# Altium project Project_Soldeerbout.PrjPcb
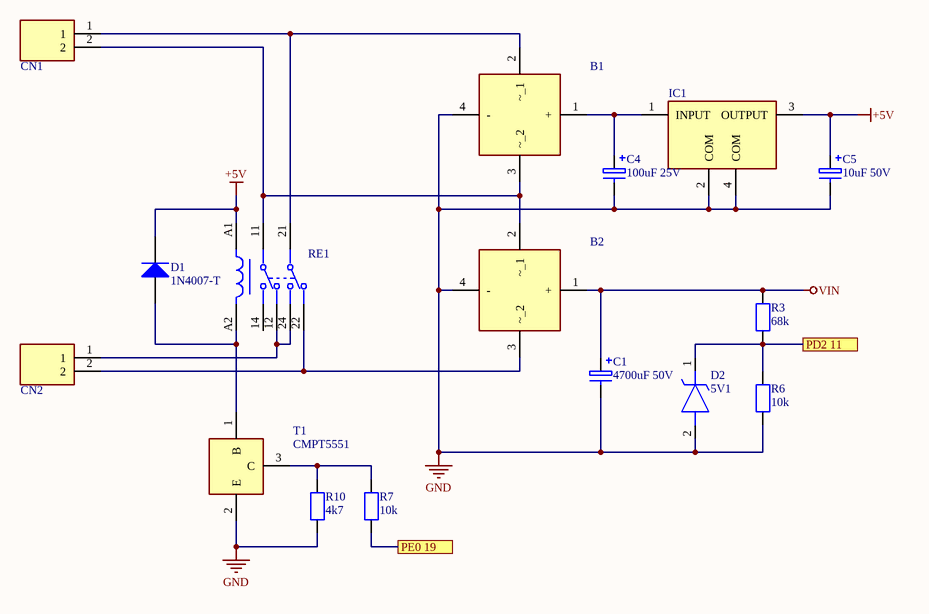
[diagram p0: Voeding_Soldeerbout.SchDoc]
3 sheets, 51 parts. Net scope: flat (ports and power ports of the same name join across sheets).
Board file: PCB1.PcbDoc
Sheets:
  Voeding_Soldeerbout.SchDoc
  Versterker.SchDoc
  CPU.SchDoc

## Sheet Voeding_Soldeerbout.SchDoc: Soldeerstation
size A4; DrawnBy: Sem Kirkels; DocumentNumber: 21P001S01; Revision: V1; SheetNumber: 1; SheetTotal: 5

### Parts
B1  GBU6J  [Bridge Rectifier]  (value not drawn)
B2  GBU6J  [Bridge Rectifier]  (value not drawn)
C1  4700uF 50V  [Elco 4700uF 50V]
C4  100uF 25V  [Elco 100uF 25V]
C5  10uF 50V  [Elco 100uF 25V]
CN1  282836-2  [2828362]  (value not drawn)
CN2  282836-2  [2828362]  (value not drawn)
D1  1N4007-T  [DIOD-DO-41-P-2_V]
D2  5V1  [DIOAD1068W53L380D172]
IC1  TL780-05CKTTR  [DC-DC Convertor]  (value not drawn)
R3  68k  [0805]
R6  10k  [0805]
R7  10k  [0805]
R10  4k7  [0805]
RE1  RT424005  [FP-RT424005-MFG]  (value not drawn)
T1  CMPT5551  [SOT95P230X109-3N]

### Ports
PD2 11, PE0 19

### Nets
+5V: C5.1 D1.2(K) IC1.3(OUTPUT) RE1.A1
GND: B1.4(-) B2.4(-) C1.2 C4.2 C5.2 D2.2(A) IC1.2(COM) IC1.4(COM) R6.1 R10.1 T1.2(E)
VIN: B2.1(+) C1.1 R3.2
NetB1_1: B1.1(+) C4.1 IC1.1(INPUT)
NetB1_2: B1.2(~_1) CN1.1 RE1.21
NetB1_3: B1.3(~_2) B2.2(~_1) CN1.2 RE1.11
NetB2_3: B2.3(~_2) CN2.2 RE1.22
NetCN2_1: CN2.1 RE1.12 RE1.24
NetD1_1: D1.1(A) RE1.A2 T1.1(B)
NetD2_1: D2.1(K) R3.1 R6.2 ; port PD2 11
NetIC3_19: R7.1 ; port PE0 19
NetR7_2: R7.2 R10.2 T1.3(C)

Not connected (* = marked no-connect by the designer): RE1 14

### Library data of the parts
B1 B2 = GBU6J: Bridge Rectifier; Manufacturer_Name: GeneSiC Semiconductor; Datasheet Link: https://www.diodemodule.com/silicon_products/bridge_rectifiers/gbu6j.pdf; Height: 18.8mm; Manufacturer_Part_Number: GBU6J
C1 C4 C5 = Condensator Elco: Part Number: 02015A270JAT2A; Manufacturer: AVX Interconnect / Elco
CN1 CN2 = Schroefconnector 2 Pin: Connector; Manufacturer_Name: TE Connectivity; Datasheet Link: https://www.te.com/commerce/DocumentDelivery/DDEController?Action=showdoc&DocId=Customer+Drawing%7F282836%7FJ%7Fpdf%7FEnglish%7FENG_CD_282836_J.pdf%7F282836-2; Height: 10mm; Manufacturer_Part_Number: 282836-2
D1 = CMP-0639-00008-2: 1.0 A Rectifier, 8 pF, 1000 V, -65 to 150 degC, 2-Pin DO-41 Plastic, RoHS, Tape and Reel; Manufacturer: Diodes Inc; Max. Average Rectified Current IO (A): 1; CT (pF): 8; Max. IR (uA): 5; VRRM (V): 1000; Max. IFSM (A): 30; Mounting Technology: Through Hole; Packing: Tape and Reel; ComponentLink1Description: Manufacturer URL; DatasheetVersion: Rev. 8-2; PackageDescription: 2-Pin Axial Lead, Body 4.635 x 2.36 mm, Lead Spread 25.4 mm; PartNumber: 1N4007-T; ComponentLink2Description: Datasheet; RoHS: TRUE; ComponentLink1URL: http://diodes.com/; ComponentLink2URL: http://diodes.com/datasheets/ds28002.pdf; Operating Temperature Range (degC): -65 to 150; VF (V): 1; PackageReference: DO-41-P-2
D2 = 1N5231CTR: Zener Diode; Manufacturer_Name: ON Semiconductor; Datasheet Link: https://componentsearchengine.com//1N5231CTR.pdf; Mouser2 Part Number: 512-1N5231CTR; Mouser2 Price/Stock: https://www.mouser.com/Search/Refine.aspx?Keyword=512-1N5231CTR; Manufacturer_Part_Number: 1N5231CTR
IC1 = DC/DC Convertor: IC REG LIN 5V 1.5A DDPAK/TO263-3; Max Input Voltage: 25V; Number of Outputs: 1; Dropout Voltage: 2V; Polarity: Positive; Output Type: Fixed; Quiescent Current: 8mA; Min Input Voltage: 7V; Power Supply Rejection Ratio (PSRR): 85dB; Accuracy: 1%; Lead Free: Lead Free; Min Operating Temperature: 0°C; Number of Pins: 3; Max Output Voltage: 5V; Case/Package: TO-263; Number of Regulators: 1; Packaging: Tape and Reel; Max Operating Temperature: 125°C; Max Output Current: 1.5A; Nominal Output Voltage: 5V; Height: 4.83mm; Mount: Surface Mount; Weight: 0.050897oz; Output Current: 1.5A; Width: 9.65mm; Output Voltage: 5V; Length: 10.67mm; REACH SVHC: No SVHC; Output Voltage Accuracy: 1%; Package Quantity: 1
R3 R6 R7 R10 = Resistor 0805: Manufacturer: Vishay Dale; Part Number: CRCW08050000Z0EA
RE1 = CMP-03395-000087-1: RELAY GENERAL PURPOSE DPDT 8A 5V; Manufacturer: TE Connectivity; Coil Power: 403mW; Number Of Contacts: 2; Coil Resistance: 62Ω; Coil Type: Non-Latching; Manufacturer Part Number: RT424005; Category: Relay; Octopart: https://octopart.com/5-1393243-9-te+connectivity-41835766; Device Class L3: Power Relays; ComponentLink2URL: https://www.te.com/commerce/DocumentDelivery/DDEController?Action=showdoc&DocId=Data+Sheet%7FRT2%7F1014%7Fpdf%7FEnglish%7FENG_DS_RT2_1014.pdf%7F5-1393243-9; Ambient Temperature Range High: +85°C; ComponentLink2Description: Datasheet; Throw Configuration: DPDT; Digikey Description: RELAY GENERAL PURPOSE DPDT 8A 5V; Package: RT424005; Automotive: No; Device Class L1: Electromechanical; Height: 15.7mm; Device Class L2: Relays; Ambient Temperature Range Low: -40°C; Coil Voltage: 5V; Current Rating: 8A; Mouser Description: General Purpose Relay, Rt2 Series, Power, Non Latching, Dpdt, 5 Vdc, 8 A Rohs Compliant: Yes; Lead Free: Yes; RoHS: TRUE
T1 = CMPT5551: Transistor; Manufacturer_Name: Central Semiconductor; Manufacturer_Part_Number: CMPT5551 TR PBFREE; Datasheet Link: https://my.centralsemi.com/datasheets/CMPT5551.PDF; Height: 1.09mm

## Sheet Versterker.SchDoc: Soldeerstation
size A4; DrawnBy: Sem Kirkels; DocumentNumber: 21P001S03; Revision: V1; SheetNumber: 3; SheetTotal: 5
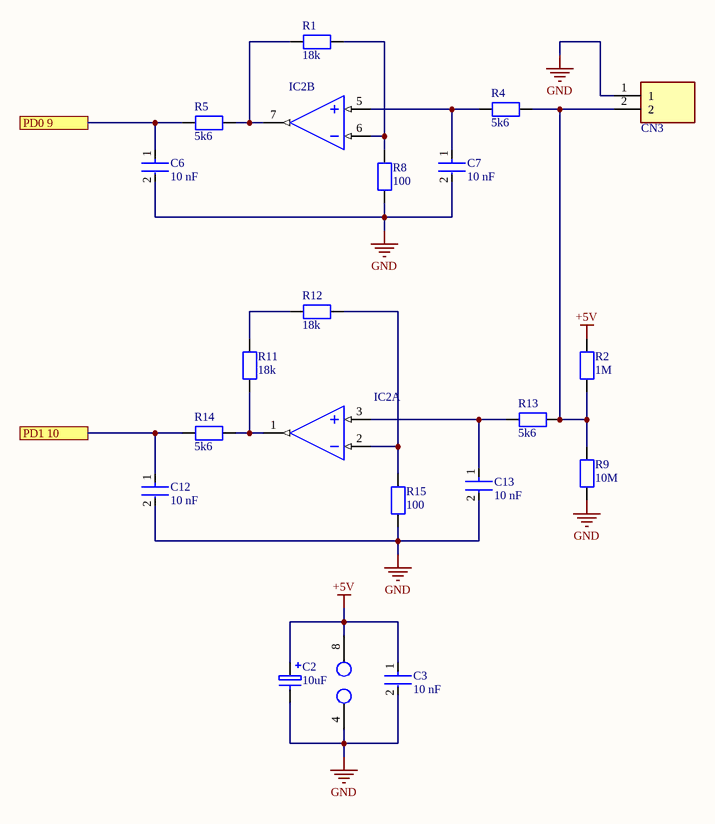
[diagram p1: Versterker.SchDoc]

### Parts
C2  10uF  [Elco 100uF 25V]
C3  10 nF  [0805]
C6  10 nF  [0805]
C7  10 nF  [0805]
C12  10 nF  [0805]
C13  10 nF  [0805]
CN3  282836-2  [2828362]  (value not drawn)
IC2  MCP6002-I/P  [Opamp]  (value not drawn)  (parts A,B of 2)
R1  18k  [0805]
R2  1M  [0805]
R4  5k6  [0805]
R5  5k6  [0805]
R8  100  [0805]
R9  10M  [0805]
R11  18k  [0805]
R12  18k  [0805]
R13  5k6  [0805]
R14  5k6  [0805]
R15  100  [0805]

### Ports
PD0 9, PD1 10

### Nets
+5V: C2.1 C3.1 IC2.8 R2.2
GND: C2.2 C3.2 C6.2 C7.2 C12.2 C13.2 CN3.1 IC2.4 R8.1 R9.1 R15.2
NetC6_1: C6.1 R5.1 ; port PD0 9
NetC7_1: C7.1 IC2.5 R4.1
NetC12_1: C12.1 R14.1 ; port PD1 10
NetC13_1: C13.1 IC2.3 R13.1
NetCN3_2: CN3.2 R2.1 R4.2 R9.2 R13.2
NetIC2_1: IC2.1 R11.2 R14.2
NetIC2_2: IC2.2 R12.2 R15.1
NetIC2_6: IC2.6 R1.2 R8.2
NetIC2_7: IC2.7 R1.1 R5.2
NetR11_1: R11.1 R12.1

### Library data of the parts
C2 = Condensator Elco: as C1 on sheet Voeding_Soldeerbout
C3 C6 C7 C12 C13 = Condensator 0805: Chip Multilayer Ceramic Capacitors for General Purpose, 0805, 10uF, X5R, 15%, 10%, 25V; Length: 2mm; Depth: 1.25mm; Termination: SMD/SMT; Voltage: 25V; Height: 1.25mm; Material: Ceramic; Thickness: 0.053inch; Radiation Hardening: No; Min Operating Temperature: -55°C; Width: 0.049inch; Package Quantity: 1; Mount: Surface Mount; Dielectric: X5R; Packaging: Tape and Reel; Capacitance: 10uF; Voltage Rating (DC): 25V; Lead Free: Lead Free; Max Operating Temperature: 85°C; Case Code (Imperial): 0805; Case/Package: 0805; Tolerance: 10%; Voltage Rating: 25V; Case Code (Metric): 2012
CN3 = Schroefconnector 2 Pin R: Connector; Manufacturer_Name: TE Connectivity; Datasheet Link: https://www.te.com/commerce/DocumentDelivery/DDEController?Action=showdoc&DocId=Customer+Drawing%7F282836%7FJ%7Fpdf%7FEnglish%7FENG_CD_282836_J.pdf%7F282836-2; Height: 10mm; Manufacturer_Part_Number: 282836-2
IC2 = Opamp: AMP-OPA-MCP6002-IL8; Max Frequency: 1kHz; Operating Supply Current: 100uA; Amplifier Type: GENERAL PURPOSE; Number of Channels: 2; Power Supply Rejection Ratio (PSRR): 86dB; Max Input Voltage: 6V; Bandwidth: 1MHz; Voltage Gain: 112dB; Input Bias Current: 1pA; Slew Rate-Nom: 0.6V/µs; Output Current: 23mA; Input Offset Voltage-Max: 4.5mV; Common Mode Rejection Ratio: 60dB; Min Input Voltage: 1.8V; Operating Supply Voltage: 5.5V; Height: 0.195inch; Number of Circuits: 2; REACH SVHC: No SVHC; Max Supply Voltage: 6V; Supply Current: 100uA; Gain Bandwidth Product: 1MHz; Radiation Hardening: No; Mount: Through Hole; Length: 0.4inch; Number of Pins: 8; Min Operating Temperature: -40°C; Case/Package: PDIP; Number of Amplifiers: 2; RoHS Compliant: Yes; Lead Free: Lead Free; Number of Elements: 2; Technology: CMOS; Width: 0.28inch; Slew Rate: 0.6V/µs; Packaging: Rail/Tube; Output Current per Channel: 23mA; Max Operating Temperature: 85°C; Nominal Supply Current: 100uA; Min Supply Voltage: 1.8V; Input Offset Voltage (Vos): 4.5mV; Unity Gain Bandwidth Product: 1MHz; Package Quantity: 60
R1 R2 R4 R5 R8 R9 R11-R15 = Resistor 0805: as R3 on sheet Voeding_Soldeerbout

## Sheet CPU.SchDoc: Soldeerstation
size A4; DrawnBy: Sem Kirkels; DocumentNumber: 21P001S04; Revision: V1; SheetNumber: 4; SheetTotal: 5
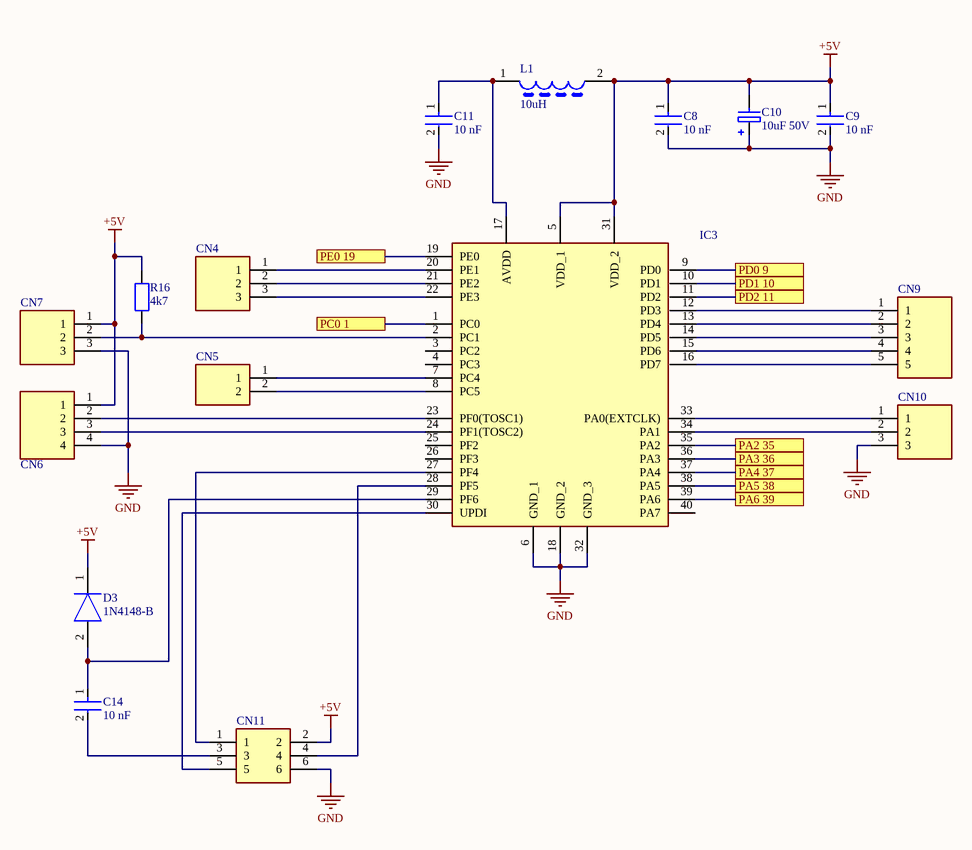
[diagram p2: CPU.SchDoc]

### Parts
C8  10 nF  [0805]
C9  10 nF  [0805]
C10  10uF 50V  [Elco 100uF 25V]
C11  10 nF  [0805]
C14  10 nF  [0805]
CN4  5-146280-3  [HDRV3W97P0X254_1X3_721X234X821P]  (value not drawn)
CN5  5-146280-2  [HDRV2W77P0X254_1X2_467X234X872P]  (value not drawn)
CN6  5-146280-4  [HDRV4W77P254_4X1_467X488X821P]  (value not drawn)
CN7  5-146280-3  [HDRV3W97P0X254_1X3_721X234X821P]  (value not drawn)
CN9  5-146280-5  [HDRV5W67P0X254_1X5_1229X234X821P]  (value not drawn)
CN10  5-146280-3  [HDRV3W97P0X254_1X3_721X234X821P]  (value not drawn)
CN11  2x3 Pin Header  [HDRV6W67P254_2X3_721X488X872P]  (value not drawn)
D3  1N4148-B  [DIOAD1220W56L420D200]
IC3  ATMEGA4809-PF  [DIP1543W58P254L5175H635Q40N]  (value not drawn)
L1  10uH  [VLS6045]
R16  4k7  [0805]

### Ports
PA2 35, PA3 36, PA4 37, PA5 38, PA6 39, PC0 1, PD0 9, PD1 10, PD2 11, PE0 19

### Nets
+5V: C8.1 C9.1 C10.2 CN6.1 CN7.1 CN11.2 D3.1(K) IC3.5(VDD_1) IC3.31(VDD_2) L1.2 R16.1
GND: C8.2 C9.2 C10.1 C11.2 CN6.4 CN7.3 CN10.3 CN11.6 IC3.6(GND_1) IC3.18(GND_2) IC3.32(GND_3)
NetC6_1: IC3.9(PD0) ; port PD0 9
NetC11_1: C11.1 IC3.17(AVDD) L1.1
NetC12_1: IC3.10(PD1) ; port PD1 10
NetC14_1: C14.1 D3.2(A) IC3.29(PF6)
NetC14_2: C14.2 CN11.3
NetCN4_1: CN4.1 IC3.20(PE1)
NetCN4_2: CN4.2 IC3.21(PE2)
NetCN4_3: CN4.3 IC3.22(PE3)
NetCN5_1: CN5.1 IC3.7(PC4)
NetCN5_2: CN5.2 IC3.8(PC5)
NetCN6_2: CN6.2 IC3.23(PF0(TOSC1))
NetCN6_3: CN6.3 IC3.24(PF1(TOSC2))
NetCN7_2: CN7.2 IC3.2(PC1) R16.2
NetCN9_1: CN9.1 IC3.12(PD3)
NetCN9_2: CN9.2 IC3.13(PD4)
NetCN9_3: CN9.3 IC3.14(PD5)
NetCN9_4: CN9.4 IC3.15(PD6)
NetCN9_5: CN9.5 IC3.16(PD7)
NetCN10_1: CN10.1 IC3.33(PA0(EXTCLK))
NetCN10_2: CN10.2 IC3.34(PA1)
NetCN11_1: CN11.1 IC3.27(PF4)
NetCN11_4: CN11.4 IC3.28(PF5)
NetCN11_5: CN11.5 IC3.30(UPDI)
NetD2_1: IC3.11(PD2) ; port PD2 11
NetIC3_1: IC3.1(PC0) ; port PC0 1
NetIC3_19: IC3.19(PE0) ; port PE0 19
NetIC3_35: IC3.35(PA2) ; port PA2 35
NetIC3_36: IC3.36(PA3) ; port PA3 36
NetIC3_37: IC3.37(PA4) ; port PA4 37
NetIC3_38: IC3.38(PA5) ; port PA5 38
NetIC3_39: IC3.39(PA6) ; port PA6 39

Not connected (* = marked no-connect by the designer): IC3 3(PC2) 4(PC3) 25(PF2) 26(PF3) 40(PA7)

### Library data of the parts
C8 C9 C11 C14 = Condensator 0805: as C3 on sheet Versterker; Length: 2mm; Depth: 1.25mm; Termination: SMD/SMT; Voltage: 25V; Height: 1.25mm; Material: Ceramic; Thickness: 0.053inch; Radiation Hardening: No; Min Operating Temperature: -55°C; Width: 0.049inch; Package Quantity: 1; Mount: Surface Mount; Dielectric: X5R; Packaging: Tape and Reel; Capacitance: 10uF; Voltage Rating (DC): 25V; Lead Free: Lead Free; Max Operating Temperature: 85°C; Case Code (Imperial): 0805; Case/Package: 0805; Tolerance: 10%; Voltage Rating: 25V; Case Code (Metric): 2012
C10 = Condensator Elco: as C1 on sheet Voeding_Soldeerbout
CN4 CN7 = 3 Pin Header L: Connector 5-146280-3; Manufacturer_Name: TE Connectivity; Datasheet Link: https://componentsearchengine.com//5-146280-3.pdf; Height: 8.21mm; Mouser2 Part Number: 571-5-146280-3; Mouser2 Price/Stock: https://www.mouser.com/Search/Refine.aspx?Keyword=571-5-146280-3; Manufacturer_Part_Number: 5-146280-3
CN5 = 2 Pin Header L: Connector; Manufacturer_Name: TE Connectivity; Datasheet Link: http://www.te.com/commerce/DocumentDelivery/DDEController?Action=showdoc&DocId=Customer+Drawing%7F146280%7FH2%7Fpdf%7FEnglish%7FENG_CD_146280_H2.pdf%7F5-146280-2; Height: 8.72mm; Manufacturer_Part_Number: 5-146280-2
CN6 = 4 Pin Header L: Connector 5-146280-4; Manufacturer_Name: TE Connectivity; Datasheet Link: https://datasheet.datasheetarchive.com/originals/distributors/DKDS-20/396066.pdf; Height: 8.21mm; Manufacturer_Part_Number: 5-146280-4
CN9 = 5 Pin Header: Connector 5-146280-5; Manufacturer_Name: TE Connectivity; Datasheet Link: https://componentsearchengine.com//5-146280-5.pdf; Height: 8.21mm; Mouser2 Part Number: 571-5-146280-5; Mouser2 Price/Stock: https://www.mouser.com/Search/Refine.aspx?Keyword=571-5-146280-5; Manufacturer_Part_Number: 5-146280-5
CN10 = 3 Pin Header: Connector 5-146280-3; Manufacturer_Name: TE Connectivity; Datasheet Link: https://componentsearchengine.com//5-146280-3.pdf; Height: 8.21mm; Mouser2 Part Number: 571-5-146280-3; Mouser2 Price/Stock: https://www.mouser.com/Search/Refine.aspx?Keyword=571-5-146280-3; Manufacturer_Part_Number: 5-146280-3
CN11 = 2x3 Pin Header: Connector; Manufacturer_Name: TE Connectivity; Manufacturer_Part_Number: 5-146256-3; Datasheet Link: https://www.te.com/commerce/DocumentDelivery/DDEController?Action=srchrtrv&DocNm=146256&DocType=Customer+Drawing&DocLang=English; Height: 8.72mm
D3 = 1N4148-B: Diode; Manufacturer_Name: Rectron; Manufacturer_Part_Number: 1N4148-B
IC3 = ATMEGA4809-PF: Integrated Circuit; Manufacturer_Name: Microchip; Datasheet Link: https://componentsearchengine.com//ATMEGA4809-PF.pdf; Height: 6.35mm; Mouser2 Part Number: 556-ATMEGA4809-PF; Mouser2 Price/Stock: https://www.mouser.com/Search/Refine.aspx?Keyword=556-ATMEGA4809-PF; Manufacturer_Part_Number: ATMEGA4809-PF
L1 = Smoorspoel: Inductor VLS6045EX-100M-H; Manufacturer_Name: TDK; Datasheet Link: https://componentsearchengine.com//VLS6045EX-100M-H.pdf; Mouser2 Part Number: 810-VLS6045EX-100M-H; Mouser2 Price/Stock: https://www.mouser.com/Search/Refine.aspx?Keyword=810-VLS6045EX-100M-H; Manufacturer_Part_Number: VLS6045EX-100M-H
R16 = Resistor 0805: as R3 on sheet Voeding_Soldeerbout

## Nets that join several sheets
+5V: Voeding_Soldeerbout (C5.1 D1.2 IC1.3 RE1.A1), Versterker (C2.1 C3.1 IC2.8 R2.2), CPU (11 pins)
GND: Voeding_Soldeerbout (11 pins), Versterker (11 pins), CPU (11 pins)
NetC6_1: Versterker (C6.1 R5.1), CPU (IC3.9)
NetC12_1: Versterker (C12.1 R14.1), CPU (IC3.10)
NetD2_1: Voeding_Soldeerbout (D2.1 R3.1 R6.2), CPU (IC3.11)
NetIC3_19: Voeding_Soldeerbout (R7.1), CPU (IC3.19)